# Altium schematic sheet 5V_Converter.SchDoc
size A
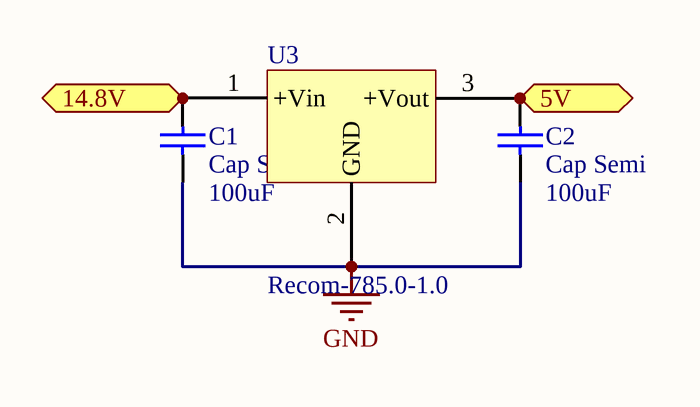
[diagram p0: 5V_Converter.SchDoc]

## Parts
C1  Cap Semi  value 100uF  [C1206]
C2  Cap Semi  value 100uF  [C1206]
U3  Recom-785.0-1.0  [Recom-78E5.0-1.0]

## Ports
5V (out), 14.8V (in)

## Nets
GND: C1.1 C2.1 U3.2(GND)
5V: C2.2 U3.3(+Vout) ; port 5V
14.8V: C1.2 U3.1(+Vin) ; port 14.8V

## Library data of the parts
C1 C2 = Cap Semi: Capacitor (Semiconductor SIM Model); Published: 8-Jun-2000; LatestRevisionDate: 29-May-2009; LatestRevisionNote: IPC-7351 Footprint Added.; PackageReference: C1206; Publisher: Altium Limited; PackageDescription: Chip Capacitor